# Altium project elevator.PrjPcb
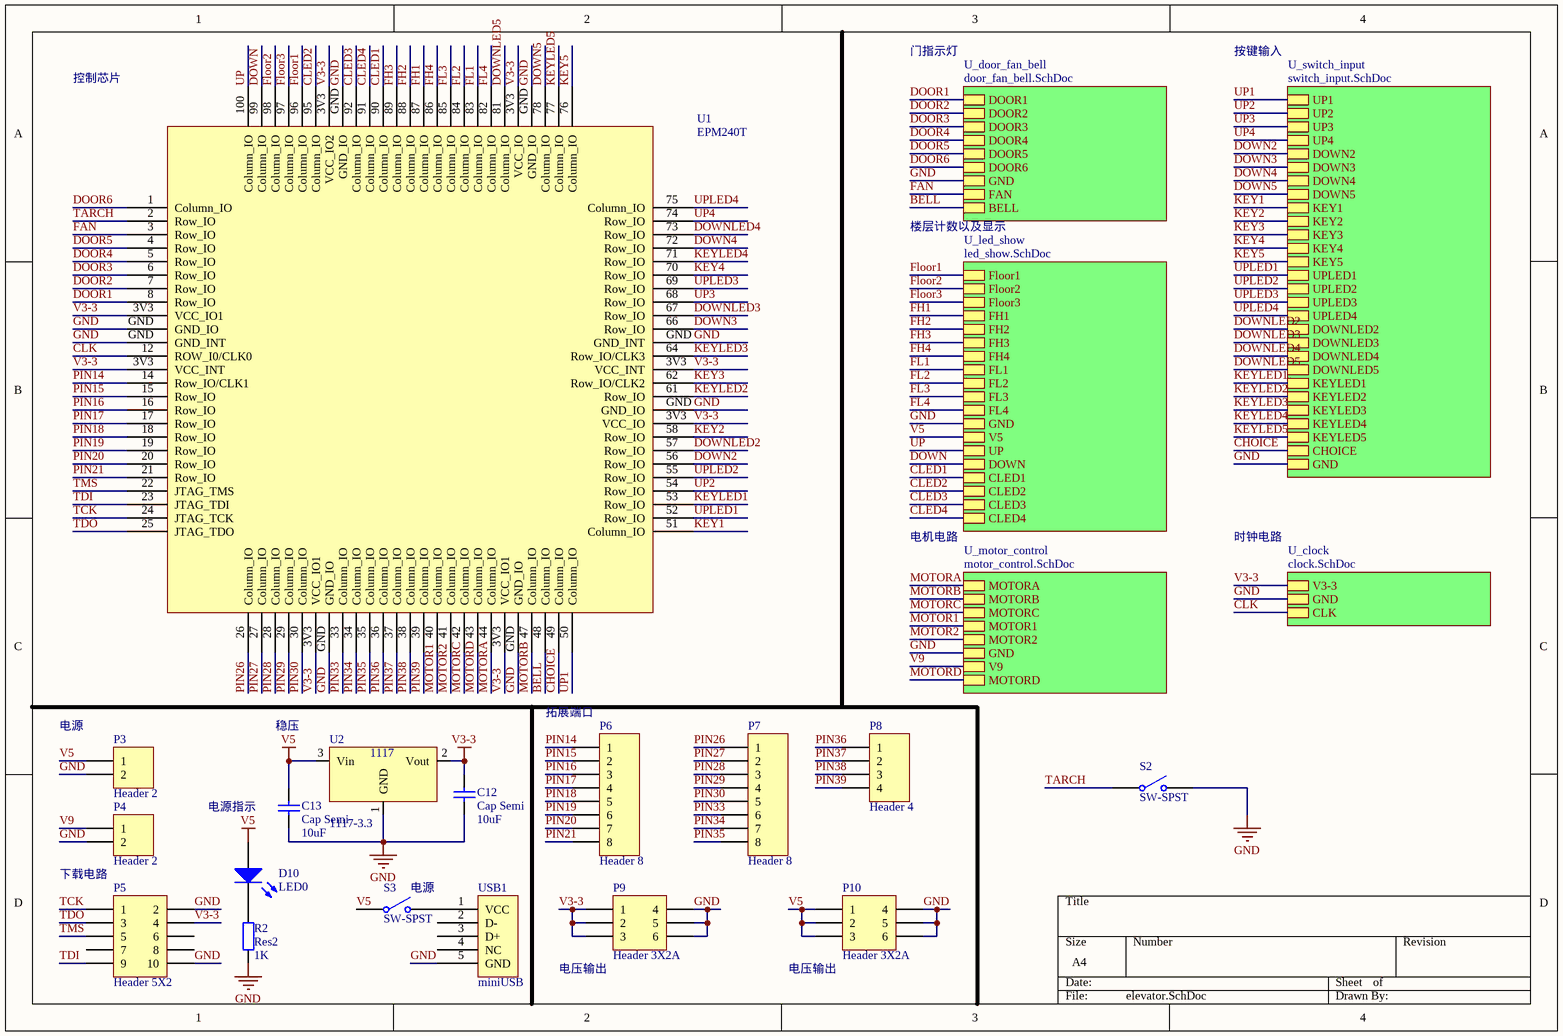
[diagram p0: elevator.SchDoc]
6 sheets, 70 parts. Net scope: hierarchical (ports join the sheet entries above them; power ports are global).
Board file: elevator.PcbDoc
Sheets:
  elevator.SchDoc
    U_door_fan_bell = door_fan_bell.SchDoc
    U_switch_input = switch_input.SchDoc
    U_clock = clock.SchDoc
    U_led_show = led_show.SchDoc
    U_motor_control = motor_control.SchDoc

## Sheet elevator.SchDoc
size A4

### Parts
C12  Cap Semi  value 10uF  [0603]
C13  Cap Semi  value 10uF  [0603]
D10  LED0  [1206]
P3  Header 2  [HDR1X2]
P4  Header 2  [HDR1X2]
P5  Header 5X2  [P_DC3]
P6  Header 8  [HDR1X8]
P7  Header 8  [HDR1X8]
P8  Header 4  [HDR1X4]
P9  Header 3X2A  [HDR2X3_CEN]
P10  Header 3X2A  [HDR2X3_CEN]
R2  Res2  value 1K  [0603]
S2  SW-SPST  [SW_TARCH]
S3  SW-SPST  [SIP3]
U1  EPM240T  [CPLD100]
U2  1117-3.3  [SOT-223]
USB1  miniUSB  [miniUSB]

### Sub-sheets
U_clock = clock.SchDoc: V3-3, GND, CLK
U_door_fan_bell = door_fan_bell.SchDoc: DOOR1, DOOR2, DOOR3, DOOR4, DOOR5, DOOR6, GND, FAN, BELL
U_led_show = led_show.SchDoc: Floor1, Floor2, Floor3, FH1, FH2, FH3, FH4, FL1, FL2, FL3, FL4, GND, V5, UP, DOWN, CLED1, CLED2, CLED3, CLED4
U_motor_control = motor_control.SchDoc: MOTORA, MOTORB, MOTORC, MOTOR1, MOTOR2, GND, V9, MOTORD
U_switch_input = switch_input.SchDoc: UP1, UP2, UP3, UP4, DOWN2, DOWN3, DOWN4, DOWN5, KEY1, KEY2, KEY3, KEY4, KEY5, UPLED1, UPLED2, UPLED3, UPLED4, DOWNLED2, DOWNLED3, DOWNLED4, DOWNLED5, KEYLED1, KEYLED2, KEYLED3, KEYLED4, KEYLED5, CHOICE, GND

### Nets
GND: C12.2 C13.2 P3.2 P4.2 P5.2 P5.10 P9.4 P9.5 P9.6 P10.4 P10.5 P10.6 R2.1 S2.2(NO) U1.GND(GND_IO) U2.1(GND) USB1.5(GND) ; sheet U_door_fan_bell/GND, sheet U_switch_input/GND, sheet U_clock/GND, sheet U_led_show/GND, sheet U_motor_control/GND
V3-3: C12.1 P5.4 P9.1 P9.2 P9.3 U1.3V3(VCC_IO1) U2.2(Vout) ; sheet U_clock/V3-3
V5: C13.1 D10.1(A) P3.1 P10.1 P10.2 P10.3 S3.1(COMMON) U2.3(Vin) ; sheet U_led_show/V5
BELL: U1.48(Column_IO) ; sheet U_door_fan_bell/BELL
CHOICE: U1.49(Column_IO) ; sheet U_switch_input/CHOICE
CLED1: U1.90(Column_IO) ; sheet U_led_show/CLED1
CLED2: U1.95(Column_IO) ; sheet U_led_show/CLED2
CLED3: U1.92(Column_IO) ; sheet U_led_show/CLED3
CLED4: U1.91(Column_IO) ; sheet U_led_show/CLED4
CLK: U1.12(ROW_I0/CLK0) ; sheet U_clock/CLK
DOOR1: U1.8(Row_IO) ; sheet U_door_fan_bell/DOOR1
DOOR2: U1.7(Row_IO) ; sheet U_door_fan_bell/DOOR2
DOOR3: U1.6(Row_IO) ; sheet U_door_fan_bell/DOOR3
DOOR4: U1.5(Row_IO) ; sheet U_door_fan_bell/DOOR4
DOOR5: U1.4(Row_IO) ; sheet U_door_fan_bell/DOOR5
DOOR6: U1.1(Column_IO) ; sheet U_door_fan_bell/DOOR6
DOWN: U1.99(Column_IO) ; sheet U_led_show/DOWN
DOWN2: U1.56(Row_IO) ; sheet U_switch_input/DOWN2
DOWN3: U1.66(Row_IO) ; sheet U_switch_input/DOWN3
DOWN4: U1.72(Row_IO) ; sheet U_switch_input/DOWN4
DOWN5: U1.78(Column_IO) ; sheet U_switch_input/DOWN5
DOWNLED2: U1.57(Row_IO) ; sheet U_switch_input/DOWNLED2
DOWNLED3: U1.67(Row_IO) ; sheet U_switch_input/DOWNLED3
DOWNLED4: U1.73(Row_IO) ; sheet U_switch_input/DOWNLED4
DOWNLED5: U1.81(Column_IO) ; sheet U_switch_input/DOWNLED5
FAN: U1.3(Row_IO) ; sheet U_door_fan_bell/FAN
FH1: U1.87(Column_IO) ; sheet U_led_show/FH1
FH2: U1.88(Column_IO) ; sheet U_led_show/FH2
FH3: U1.89(Column_IO) ; sheet U_led_show/FH3
FH4: U1.86(Column_IO) ; sheet U_led_show/FH4
FL1: U1.83(Column_IO) ; sheet U_led_show/FL1
FL2: U1.84(Column_IO) ; sheet U_led_show/FL2
FL3: U1.85(Column_IO) ; sheet U_led_show/FL3
FL4: U1.82(Column_IO) ; sheet U_led_show/FL4
Floor1: U1.96(Column_IO) ; sheet U_led_show/Floor1
Floor2: U1.98(Column_IO) ; sheet U_led_show/Floor2
Floor3: U1.97(Column_IO) ; sheet U_led_show/Floor3
KEY1: U1.51(Column_IO) ; sheet U_switch_input/KEY1
KEY2: U1.58(Row_IO) ; sheet U_switch_input/KEY2
KEY3: U1.62(Row_IO/CLK2) ; sheet U_switch_input/KEY3
KEY4: U1.70(Row_IO) ; sheet U_switch_input/KEY4
KEY5: U1.76(Column_IO) ; sheet U_switch_input/KEY5
KEYLED1: U1.53(Row_IO) ; sheet U_switch_input/KEYLED1
KEYLED2: U1.61(Row_IO) ; sheet U_switch_input/KEYLED2
KEYLED3: U1.64(Row_IO/CLK3) ; sheet U_switch_input/KEYLED3
KEYLED4: U1.71(Row_IO) ; sheet U_switch_input/KEYLED4
KEYLED5: U1.77(Column_IO) ; sheet U_switch_input/KEYLED5
MOTOR1: U1.40(Column_IO) ; sheet U_motor_control/MOTOR1
MOTOR2: U1.41(Column_IO) ; sheet U_motor_control/MOTOR2
MOTORA: U1.44(Column_IO) ; sheet U_motor_control/MOTORA
MOTORB: U1.47(Column_IO) ; sheet U_motor_control/MOTORB
MOTORC: U1.42(Column_IO) ; sheet U_motor_control/MOTORC
MOTORD: U1.43(Column_IO) ; sheet U_motor_control/MOTORD
PIN14: P6.1 U1.14(Row_IO/CLK1)
PIN15: P6.2 U1.15(Row_IO)
PIN16: P6.3 U1.16(Row_IO)
PIN17: P6.4 U1.17(Row_IO)
PIN18: P6.5 U1.18(Row_IO)
PIN19: P6.6 U1.19(Row_IO)
PIN20: P6.7 U1.20(Row_IO)
PIN21: P6.8 U1.21(Row_IO)
PIN26: P7.1 U1.26(Column_IO)
PIN27: P7.2 U1.27(Column_IO)
PIN28: P7.3 U1.28(Column_IO)
PIN29: P7.4 U1.29(Column_IO)
PIN30: P7.5 U1.30(Column_IO)
PIN33: P7.6 U1.33(Column_IO)
PIN34: P7.7 U1.34(Column_IO)
PIN35: P7.8 U1.35(Column_IO)
PIN36: P8.1 U1.36(Column_IO)
PIN37: P8.2 U1.37(Column_IO)
PIN38: P8.3 U1.38(Column_IO)
PIN39: P8.4 U1.39(Column_IO)
TARCH: S2.1(COMMON) U1.2(Row_IO)
TCK: P5.1 U1.24(JTAG_TCK)
TDI: P5.9 U1.23(JTAG_TDI)
TDO: P5.3 U1.25(JTAG_TDO)
TMS: P5.5 U1.22(JTAG_TMS)
UP: U1.100(Column_IO) ; sheet U_led_show/UP
UP1: U1.50(Column_IO) ; sheet U_switch_input/UP1
UP2: U1.54(Row_IO) ; sheet U_switch_input/UP2
UP3: U1.68(Row_IO) ; sheet U_switch_input/UP3
UP4: U1.74(Row_IO) ; sheet U_switch_input/UP4
UPLED1: U1.52(Row_IO) ; sheet U_switch_input/UPLED1
UPLED2: U1.55(Row_IO) ; sheet U_switch_input/UPLED2
UPLED3: U1.69(Row_IO) ; sheet U_switch_input/UPLED3
UPLED4: U1.75(Column_IO) ; sheet U_switch_input/UPLED4
V9: P4.1 ; sheet U_motor_control/V9
NetD10_2: D10.2(K) R2.2
NetS3_2: S3.2(NO) USB1.1(VCC)

Not connected (* = marked no-connect by the designer): P5 6 7 8; USB1 2(D-) 3(D+) 4(NC)

### Notes on the sheet
- 控制芯片
- 门指示灯
- 按键输入
- 楼层计数以及显示
- 电机电路
- 时钟电路
- (near P6) 拓展端口
- (near P3) 电源
- 稳压
- 电源指示
- 下载电路
- (near S3) 电源
- (near P9) 电压输出
- (near P10) 电压输出
- (in symbol 1117B) 1117

### Library data of the parts
C12 C13 = Cap Semi: Capacitor (Semiconductor SIM Model); Published: 8-Jun-2000; LatestRevisionDate: 17-Jul-2002; LatestRevisionNote: Re-released for DXP Platform.; PackageReference: C1206; Publisher: Altium Limited
D10 = LED0: Typical INFRARED GaAs LED; Published: 8-Jun-2000; LatestRevisionDate: 08-Jul-2005; LatestRevisionNote: Mech Layer 1 removed.; PackageReference: LED-0; Publisher: Altium Limited; PackageDescription: LED; 2 Leads
P3 P4 = Header 2: Header, 2-Pin; LatestRevisionDate: 17-Jul-2002; LatestRevisionNote: Re-released for DXP Platform.; Publisher: Altium Limited
P5 = Header 5X2: Header, 5-Pin, Dual row; LatestRevisionDate: 17-Jul-2002; LatestRevisionNote: Re-released for DXP Platform.; Publisher: Altium Limited
P6 P7 = Header 8: Header, 8-Pin; LatestRevisionDate: 17-Jul-2002; LatestRevisionNote: Re-released for DXP Platform.; Publisher: Altium Limited
P8 = Header 4: Header, 4-Pin; LatestRevisionDate: 17-Jul-2002; LatestRevisionNote: Re-released for DXP Platform.; Publisher: Altium Limited
P9 P10 = Header 3X2A: Header, 3-Pin, Dual row; LatestRevisionDate: 17-Jul-2002; LatestRevisionNote: Re-released for DXP Platform.; Publisher: Altium Limited
R2 = Res2: Resistor; Published: 8-Jun-2000; LatestRevisionDate: 17-Jul-2002; LatestRevisionNote: Re-released for DXP Platform.; PackageReference: AXIAL-0.4; Publisher: Altium Limited; PackageDescription: Axial Device, Thru-Hole; 2 Leads; 0.4 in Pin Spacing
S2 S3 = SW-SPST: Single-Pole, Single-Throw Switch; Published: 24-Mar-1999; LatestRevisionDate: 17-Jul-2002; LatestRevisionNote: Re-released for DXP Platform.; PackageReference: SPST-2; Publisher: Altium Limited; PackageDescription: Switch; 2 Leads
U1 = EPM240T1005
U2 = 1117B

## Sheet door_fan_bell.SchDoc
size A4
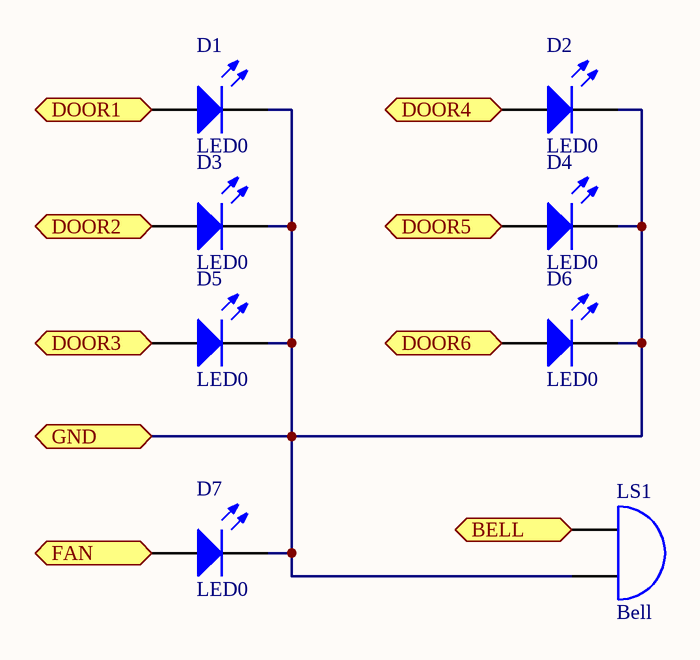
[diagram p1: door_fan_bell.SchDoc]

### Parts
D1  LED0  [1206]
D2  LED0  [1206]
D3  LED0  [1206]
D4  LED0  [1206]
D5  LED0  [1206]
D6  LED0  [1206]
D7  LED0  [1206]
LS1  Bell  [蜂鸣器]

### Ports
BELL, DOOR1, DOOR2, DOOR3, DOOR4, DOOR5, DOOR6, FAN, GND

### Nets
GND: D1.2(K) D2.2(K) D3.2(K) D4.2(K) D5.2(K) D6.2(K) D7.2(K) LS1.2(B) ; port GND
BELL: LS1.1(A) ; port BELL
DOOR1: D1.1(A) ; port DOOR1
DOOR2: D3.1(A) ; port DOOR2
DOOR3: D5.1(A) ; port DOOR3
DOOR4: D2.1(A) ; port DOOR4
DOOR5: D4.1(A) ; port DOOR5
DOOR6: D6.1(A) ; port DOOR6
FAN: D7.1(A) ; port FAN

### Library data of the parts
D1-D7 = LED0: Typical INFRARED GaAs LED; Published: 8-Jun-2000; LatestRevisionDate: 08-Jul-2005; LatestRevisionNote: Mech Layer 1 removed.; PackageReference: LED-0; Publisher: Altium Limited; PackageDescription: LED; 2 Leads
LS1 = Bell: Electrical Bell; Published: 24-Mar-1999; LatestRevisionDate: 17-Jul-2002; LatestRevisionNote: Re-released for DXP Platform.; PackageReference: PIN2; Publisher: Altium Limited

## Sheet switch_input.SchDoc
size A4
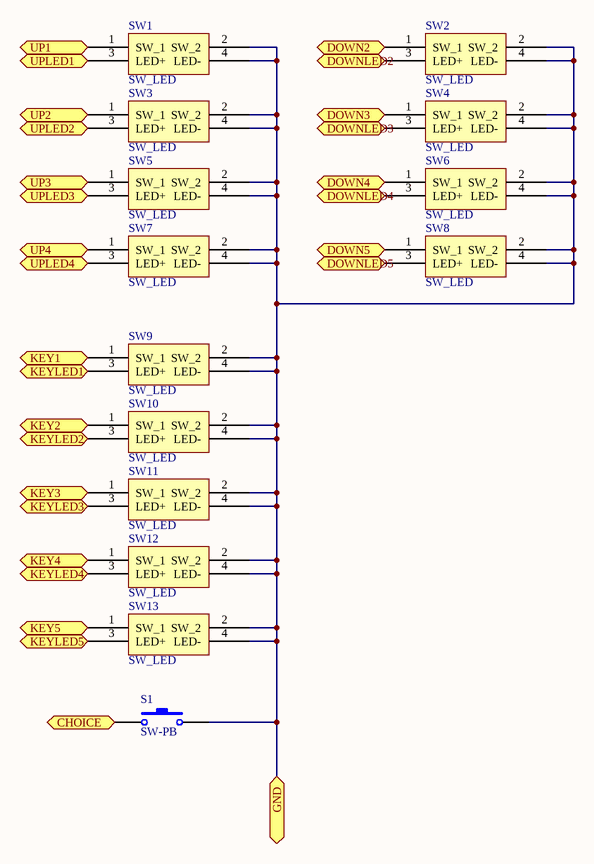
[diagram p2: switch_input.SchDoc]

### Parts
S1  SW-PB  [SW2]
SW1  SW_LED  [SW_LED]
SW2  SW_LED  [SW_LED]
SW3  SW_LED  [SW_LED]
SW4  SW_LED  [SW_LED]
SW5  SW_LED  [SW_LED]
SW6  SW_LED  [SW_LED]
SW7  SW_LED  [SW_LED]
SW8  SW_LED  [SW_LED]
SW9  SW_LED  [SW_LED]
SW10  SW_LED  [SW_LED]
SW11  SW_LED  [SW_LED]
SW12  SW_LED  [SW_LED]
SW13  SW_LED  [SW_LED]

### Ports
CHOICE, DOWN2, DOWN3, DOWN4, DOWN5, DOWNLED2, DOWNLED3, DOWNLED4, DOWNLED5, GND, KEY1, KEY2, KEY3, KEY4, KEY5, KEYLED1, KEYLED2, KEYLED3, KEYLED4, KEYLED5, UP1, UP2, UP3, UP4, UPLED1, UPLED2, UPLED3, UPLED4

### Nets
GND: S1.2 SW1.2(SW_2) SW1.4(LED-) SW2.2(SW_2) SW2.4(LED-) SW3.2(SW_2) SW3.4(LED-) SW4.2(SW_2) SW4.4(LED-) SW5.2(SW_2) SW5.4(LED-) SW6.2(SW_2) SW6.4(LED-) SW7.2(SW_2) SW7.4(LED-) SW8.2(SW_2) SW8.4(LED-) SW9.2(SW_2) SW9.4(LED-) SW10.2(SW_2) SW10.4(LED-) SW11.2(SW_2) SW11.4(LED-) SW12.2(SW_2) SW12.4(LED-) SW13.2(SW_2) SW13.4(LED-) ; port GND
CHOICE: S1.1 ; port CHOICE
DOWN2: SW2.1(SW_1) ; port DOWN2
DOWN3: SW4.1(SW_1) ; port DOWN3
DOWN4: SW6.1(SW_1) ; port DOWN4
DOWN5: SW8.1(SW_1) ; port DOWN5
DOWNLED2: SW2.3(LED+) ; port DOWNLED2
DOWNLED3: SW4.3(LED+) ; port DOWNLED3
DOWNLED4: SW6.3(LED+) ; port DOWNLED4
DOWNLED5: SW8.3(LED+) ; port DOWNLED5
KEY1: SW9.1(SW_1) ; port KEY1
KEY2: SW10.1(SW_1) ; port KEY2
KEY3: SW11.1(SW_1) ; port KEY3
KEY4: SW12.1(SW_1) ; port KEY4
KEY5: SW13.1(SW_1) ; port KEY5
KEYLED1: SW9.3(LED+) ; port KEYLED1
KEYLED2: SW10.3(LED+) ; port KEYLED2
KEYLED3: SW11.3(LED+) ; port KEYLED3
KEYLED4: SW12.3(LED+) ; port KEYLED4
KEYLED5: SW13.3(LED+) ; port KEYLED5
UP1: SW1.1(SW_1) ; port UP1
UP2: SW3.1(SW_1) ; port UP2
UP3: SW5.1(SW_1) ; port UP3
UP4: SW7.1(SW_1) ; port UP4
UPLED1: SW1.3(LED+) ; port UPLED1
UPLED2: SW3.3(LED+) ; port UPLED2
UPLED3: SW5.3(LED+) ; port UPLED3
UPLED4: SW7.3(LED+) ; port UPLED4

### Library data of the parts
S1 = SW-PB: Switch; Published: 24-Mar-1999; LatestRevisionDate: 17-Jul-2002; LatestRevisionNote: Re-released for DXP Platform.; PackageReference: SPST-2; Publisher: Altium Limited; PackageDescription: Switch; 2 Leads

## Sheet clock.SchDoc
size A4
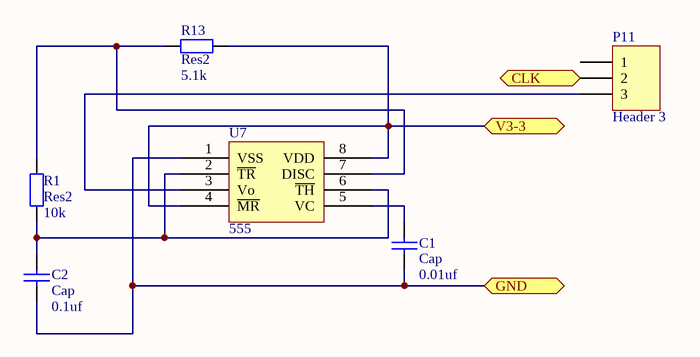
[diagram p3: clock.SchDoc]

### Parts
C1  Cap  value 0.01uf  [0603]
C2  Cap  value 0.1uf  [0603]
P11  Header 3  [HDR1X3]
R1  Res2  value 10k  [0603]
R13  Res2  value 5.1k  [0603]
U7  555  [SOP-8]

### Ports
CLK, GND, V3-3

### Nets
GND: C1.1 C2.1 U7.1(VSS) ; port GND
V3-3: R13.1 U7.4(~{MR}) U7.8(VDD) ; port V3-3
CLK: P11.2 ; port CLK
NetC1_2: C1.2 U7.5(VC)
NetC2_2: C2.2 R1.1 U7.2(~{TR}) U7.6(~{TH})
NetP11_3: P11.3 U7.3(Vo)
NetR1_2: R1.2 R13.2 U7.7(DISC)

Not connected (* = marked no-connect by the designer): P11 1

### Library data of the parts
C1 C2 = Cap: Capacitor; Published: 8-Jun-2000; LatestRevisionDate: 17-Jul-2002; LatestRevisionNote: Re-released for DXP Platform.; PackageReference: RAD-0.3; Publisher: Altium Limited; PackageDescription: Radial Cap, Thru-Hole; 2 Leads; 0.3 in Pin Spacing
P11 = Header 3: Header, 3-Pin; LatestRevisionDate: 17-Jul-2002; LatestRevisionNote: Re-released for DXP Platform.; Publisher: Altium Limited
R1 R13 = Res2: Resistor; Published: 8-Jun-2000; LatestRevisionDate: 17-Jul-2002; LatestRevisionNote: Re-released for DXP Platform.; PackageReference: AXIAL-0.4; Publisher: Altium Limited; PackageDescription: Axial Device, Thru-Hole; 2 Leads; 0.4 in Pin Spacing
U7 = NE555

## Sheet led_show.SchDoc
size A4
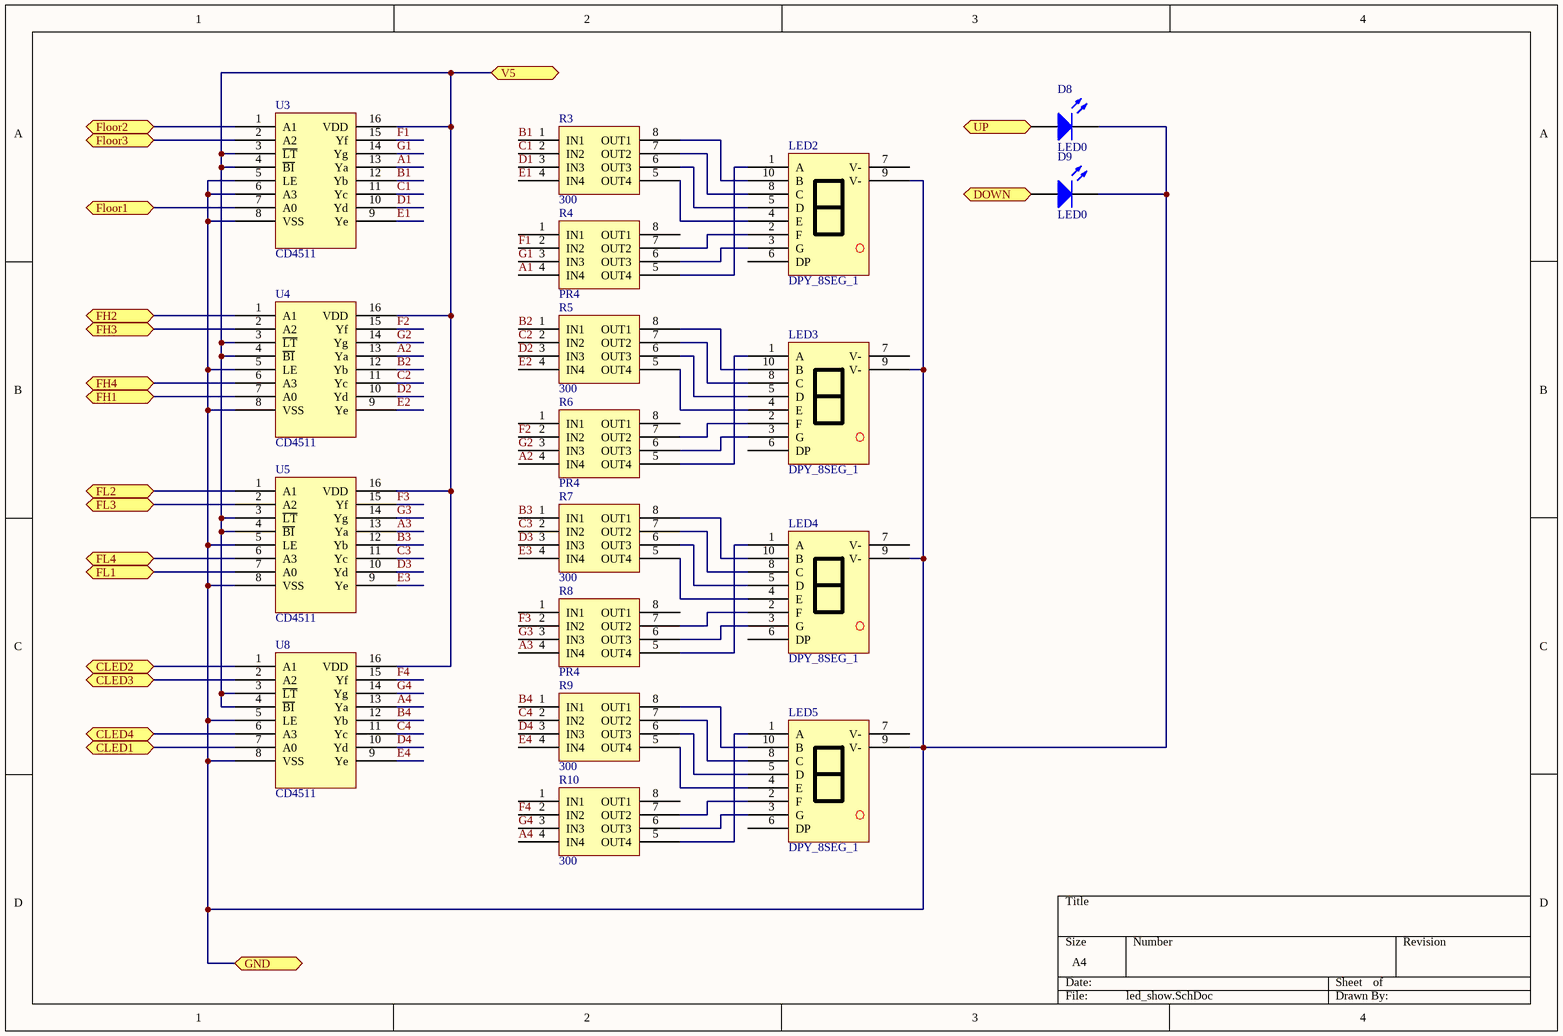
[diagram p4: led_show.SchDoc]

### Parts
D8  LED0  [1206]
D9  LED0  [1206]
LED2  DPY_8SEG_1  [LED_SEG8]
LED3  DPY_8SEG_1  [LED_SEG8]
LED4  DPY_8SEG_1  [LED_SEG8]
LED5  DPY_8SEG_1  [LED_SEG8]
R3  300  [PR_4R]
R4  PR4  [PR_4R]
R5  300  [PR_4R]
R6  PR4  [PR_4R]
R7  300  [PR_4R]
R8  PR4  [PR_4R]
R9  300  [PR_4R]
R10  300  [PR_4R]
U3  CD4511  [SOP-16]
U4  CD4511  [SOP-16]
U5  CD4511  [SOP-16]
U8  CD4511  [SOP-16]

### Ports
CLED1, CLED2, CLED3, CLED4, DOWN, FH1, FH2, FH3, FH4, FL1, FL2, FL3, FL4, Floor1, Floor2, Floor3, GND, UP, V5

### Nets
GND: D8.2(K) D9.2(K) LED2.9(V-) LED3.9(V-) LED4.9(V-) LED5.9(V-) U3.5(LE) U3.6(A3) U3.8(VSS) U4.5(LE) U4.8(VSS) U5.5(LE) U5.8(VSS) U8.5(LE) U8.8(VSS) ; port GND
V5: U3.3(~{LT}) U3.4(~{BI}) U3.16(VDD) U4.3(~{LT}) U4.4(~{BI}) U4.16(VDD) U5.3(~{LT}) U5.4(~{BI}) U5.16(VDD) U8.3(~{LT}) U8.4(~{BI}) U8.16(VDD) ; port V5
A1: R4.4(IN4) U3.13(Ya)
A2: R6.4(IN4) U4.13(Ya)
A3: R8.4(IN4) U5.13(Ya)
A4: R10.4(IN4) U8.13(Ya)
B1: R3.1(IN1) U3.12(Yb)
B2: R5.1(IN1) U4.12(Yb)
B3: R7.1(IN1) U5.12(Yb)
B4: R9.1(IN1) U8.12(Yb)
C1: R3.2(IN2) U3.11(Yc)
C2: R5.2(IN2) U4.11(Yc)
C3: R7.2(IN2) U5.11(Yc)
C4: R9.2(IN2) U8.11(Yc)
CLED1: U8.7(A0) ; port CLED1
CLED2: U8.1(A1) ; port CLED2
CLED3: U8.2(A2) ; port CLED3
CLED4: U8.6(A3) ; port CLED4
D1: R3.3(IN3) U3.10(Yd)
D2: R5.3(IN3) U4.10(Yd)
D3: R7.3(IN3) U5.10(Yd)
D4: R9.3(IN3) U8.10(Yd)
DOWN: D9.1(A) ; port DOWN
E1: R3.4(IN4) U3.9(Ye)
E2: R5.4(IN4) U4.9(Ye)
E3: R7.4(IN4) U5.9(Ye)
E4: R9.4(IN4) U8.9(Ye)
F1: R4.2(IN2) U3.15(Yf)
F2: R6.2(IN2) U4.15(Yf)
F3: R8.2(IN2) U5.15(Yf)
F4: R10.2(IN2) U8.15(Yf)
FH1: U4.7(A0) ; port FH1
FH2: U4.1(A1) ; port FH2
FH3: U4.2(A2) ; port FH3
FH4: U4.6(A3) ; port FH4
FL1: U5.7(A0) ; port FL1
FL2: U5.1(A1) ; port FL2
FL3: U5.2(A2) ; port FL3
FL4: U5.6(A3) ; port FL4
Floor1: U3.7(A0) ; port Floor1
Floor2: U3.1(A1) ; port Floor2
Floor3: U3.2(A2) ; port Floor3
G1: R4.3(IN3) U3.14(Yg)
G2: R6.3(IN3) U4.14(Yg)
G3: R8.3(IN3) U5.14(Yg)
G4: R10.3(IN3) U8.14(Yg)
UP: D8.1(A) ; port UP
NetLED2_1: LED2.1(A) R4.5(OUT4)
NetLED2_2: LED2.2(F) R4.7(OUT2)
NetLED2_3: LED2.3(G) R4.6(OUT3)
NetLED2_4: LED2.4(E) R3.5(OUT4)
NetLED2_5: LED2.5(D) R3.6(OUT3)
NetLED2_8: LED2.8(C) R3.7(OUT2)
NetLED2_10: LED2.10(B) R3.8(OUT1)
NetLED3_1: LED3.1(A) R6.5(OUT4)
NetLED3_2: LED3.2(F) R6.7(OUT2)
NetLED3_3: LED3.3(G) R6.6(OUT3)
NetLED3_4: LED3.4(E) R5.5(OUT4)
NetLED3_5: LED3.5(D) R5.6(OUT3)
NetLED3_8: LED3.8(C) R5.7(OUT2)
NetLED3_10: LED3.10(B) R5.8(OUT1)
NetLED4_1: LED4.1(A) R8.5(OUT4)
NetLED4_2: LED4.2(F) R8.7(OUT2)
NetLED4_3: LED4.3(G) R8.6(OUT3)
NetLED4_4: LED4.4(E) R7.5(OUT4)
NetLED4_5: LED4.5(D) R7.6(OUT3)
NetLED4_8: LED4.8(C) R7.7(OUT2)
NetLED4_10: LED4.10(B) R7.8(OUT1)
NetLED5_1: LED5.1(A) R10.5(OUT4)
NetLED5_2: LED5.2(F) R10.7(OUT2)
NetLED5_3: LED5.3(G) R10.6(OUT3)
NetLED5_4: LED5.4(E) R9.5(OUT4)
NetLED5_5: LED5.5(D) R9.6(OUT3)
NetLED5_8: LED5.8(C) R9.7(OUT2)
NetLED5_10: LED5.10(B) R9.8(OUT1)

Not connected (* = marked no-connect by the designer): LED2 6(DP) 7(V-); LED3 6(DP) 7(V-); LED4 6(DP) 7(V-); LED5 6(DP) 7(V-); R4 1(IN1) 8(OUT1); R6 1(IN1) 8(OUT1); R8 1(IN1) 8(OUT1); R10 1(IN1) 8(OUT1)

### Library data of the parts
D8 D9 = LED0: Typical INFRARED GaAs LED; Published: 8-Jun-2000; LatestRevisionDate: 08-Jul-2005; LatestRevisionNote: Mech Layer 1 removed.; PackageReference: LED-0; Publisher: Altium Limited; PackageDescription: LED; 2 Leads
LED2-LED5 = DPY8_1
R3-R10 = PResister

## Sheet motor_control.SchDoc
size A4
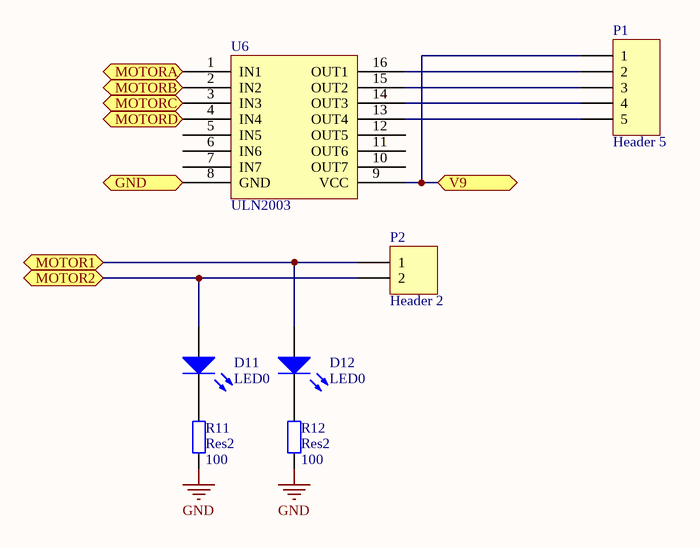
[diagram p5: motor_control.SchDoc]

### Parts
D11  LED0  [1206]
D12  LED0  [1206]
P1  Header 5  [HDR1X5]
P2  Header 2  [HDR1X2]
R11  Res2  value 100  [0603]
R12  Res2  value 100  [0603]
U6  ULN2003  [SOP-16]

### Ports
GND, MOTOR1, MOTOR2, MOTORA, MOTORB, MOTORC, MOTORD, V9

### Nets
GND: R11.1 R12.1 U6.8(GND) ; port GND
MOTOR1: D12.1(A) P2.1 ; port MOTOR1
MOTOR2: D11.1(A) P2.2 ; port MOTOR2
MOTORA: U6.1(IN1) ; port MOTORA
MOTORB: U6.2(IN2) ; port MOTORB
MOTORC: U6.3(IN3) ; port MOTORC
MOTORD: U6.4(IN4) ; port MOTORD
V9: P1.1 U6.9(VCC) ; port V9
NetD11_2: D11.2(K) R11.2
NetD12_2: D12.2(K) R12.2
NetP1_2: P1.2 U6.16(OUT1)
NetP1_3: P1.3 U6.15(OUT2)
NetP1_4: P1.4 U6.14(OUT3)
NetP1_5: P1.5 U6.13(OUT4)

Not connected (* = marked no-connect by the designer): U6 5(IN5) 6(IN6) 7(IN7) 10(OUT7) 11(OUT6) 12(OUT5)

### Library data of the parts
D11 D12 = LED0: Typical INFRARED GaAs LED; Published: 8-Jun-2000; LatestRevisionDate: 08-Jul-2005; LatestRevisionNote: Mech Layer 1 removed.; PackageReference: LED-0; Publisher: Altium Limited; PackageDescription: LED; 2 Leads
P1 = Header 5: Header, 5-Pin; LatestRevisionDate: 17-Jul-2002; LatestRevisionNote: Re-released for DXP Platform.; Publisher: Altium Limited
P2 = Header 2: Header, 2-Pin; LatestRevisionDate: 17-Jul-2002; LatestRevisionNote: Re-released for DXP Platform.; Publisher: Altium Limited
R11 R12 = Res2: Resistor; Published: 8-Jun-2000; LatestRevisionDate: 17-Jul-2002; LatestRevisionNote: Re-released for DXP Platform.; PackageReference: AXIAL-0.4; Publisher: Altium Limited; PackageDescription: Axial Device, Thru-Hole; 2 Leads; 0.4 in Pin Spacing

## Nets that join several sheets
GND: elevator (17 pins), door_fan_bell (8 pins), switch_input (27 pins), clock (C1.1 C2.1 U7.1), led_show (15 pins), motor_control (R11.1 R12.1 U6.8)
V3-3: elevator (7 pins), clock (R13.1 U7.4 U7.8)
V5: elevator (8 pins), led_show (12 pins)
BELL: elevator (U1.48), door_fan_bell (LS1.1)
CHOICE: elevator (U1.49), switch_input (S1.1)
CLED1: elevator (U1.90), led_show (U8.7)
CLED2: elevator (U1.95), led_show (U8.1)
CLED3: elevator (U1.92), led_show (U8.2)
CLED4: elevator (U1.91), led_show (U8.6)
CLK: elevator (U1.12), clock (P11.2)
DOOR1: elevator (U1.8), door_fan_bell (D1.1)
DOOR2: elevator (U1.7), door_fan_bell (D3.1)
DOOR3: elevator (U1.6), door_fan_bell (D5.1)
DOOR4: elevator (U1.5), door_fan_bell (D2.1)
DOOR5: elevator (U1.4), door_fan_bell (D4.1)
DOOR6: elevator (U1.1), door_fan_bell (D6.1)
DOWN: elevator (U1.99), led_show (D9.1)
DOWN2: elevator (U1.56), switch_input (SW2.1)
DOWN3: elevator (U1.66), switch_input (SW4.1)
DOWN4: elevator (U1.72), switch_input (SW6.1)
DOWN5: elevator (U1.78), switch_input (SW8.1)
DOWNLED2: elevator (U1.57), switch_input (SW2.3)
DOWNLED3: elevator (U1.67), switch_input (SW4.3)
DOWNLED4: elevator (U1.73), switch_input (SW6.3)
DOWNLED5: elevator (U1.81), switch_input (SW8.3)
FAN: elevator (U1.3), door_fan_bell (D7.1)
FH1: elevator (U1.87), led_show (U4.7)
FH2: elevator (U1.88), led_show (U4.1)
FH3: elevator (U1.89), led_show (U4.2)
FH4: elevator (U1.86), led_show (U4.6)
FL1: elevator (U1.83), led_show (U5.7)
FL2: elevator (U1.84), led_show (U5.1)
FL3: elevator (U1.85), led_show (U5.2)
FL4: elevator (U1.82), led_show (U5.6)
Floor1: elevator (U1.96), led_show (U3.7)
Floor2: elevator (U1.98), led_show (U3.1)
Floor3: elevator (U1.97), led_show (U3.2)
KEY1: elevator (U1.51), switch_input (SW9.1)
KEY2: elevator (U1.58), switch_input (SW10.1)
KEY3: elevator (U1.62), switch_input (SW11.1)
KEY4: elevator (U1.70), switch_input (SW12.1)
KEY5: elevator (U1.76), switch_input (SW13.1)
KEYLED1: elevator (U1.53), switch_input (SW9.3)
KEYLED2: elevator (U1.61), switch_input (SW10.3)
KEYLED3: elevator (U1.64), switch_input (SW11.3)
KEYLED4: elevator (U1.71), switch_input (SW12.3)
KEYLED5: elevator (U1.77), switch_input (SW13.3)
MOTOR1: elevator (U1.40), motor_control (D12.1 P2.1)
MOTOR2: elevator (U1.41), motor_control (D11.1 P2.2)
MOTORA: elevator (U1.44), motor_control (U6.1)
MOTORB: elevator (U1.47), motor_control (U6.2)
MOTORC: elevator (U1.42), motor_control (U6.3)
MOTORD: elevator (U1.43), motor_control (U6.4)
UP: elevator (U1.100), led_show (D8.1)
UP1: elevator (U1.50), switch_input (SW1.1)
UP2: elevator (U1.54), switch_input (SW3.1)
UP3: elevator (U1.68), switch_input (SW5.1)
UP4: elevator (U1.74), switch_input (SW7.1)
UPLED1: elevator (U1.52), switch_input (SW1.3)
UPLED2: elevator (U1.55), switch_input (SW3.3)
UPLED3: elevator (U1.69), switch_input (SW5.3)
UPLED4: elevator (U1.75), switch_input (SW7.3)
V9: elevator (P4.1), motor_control (P1.1 U6.9)